# Altium schematic sheet Sheet1.SchDoc
size A4
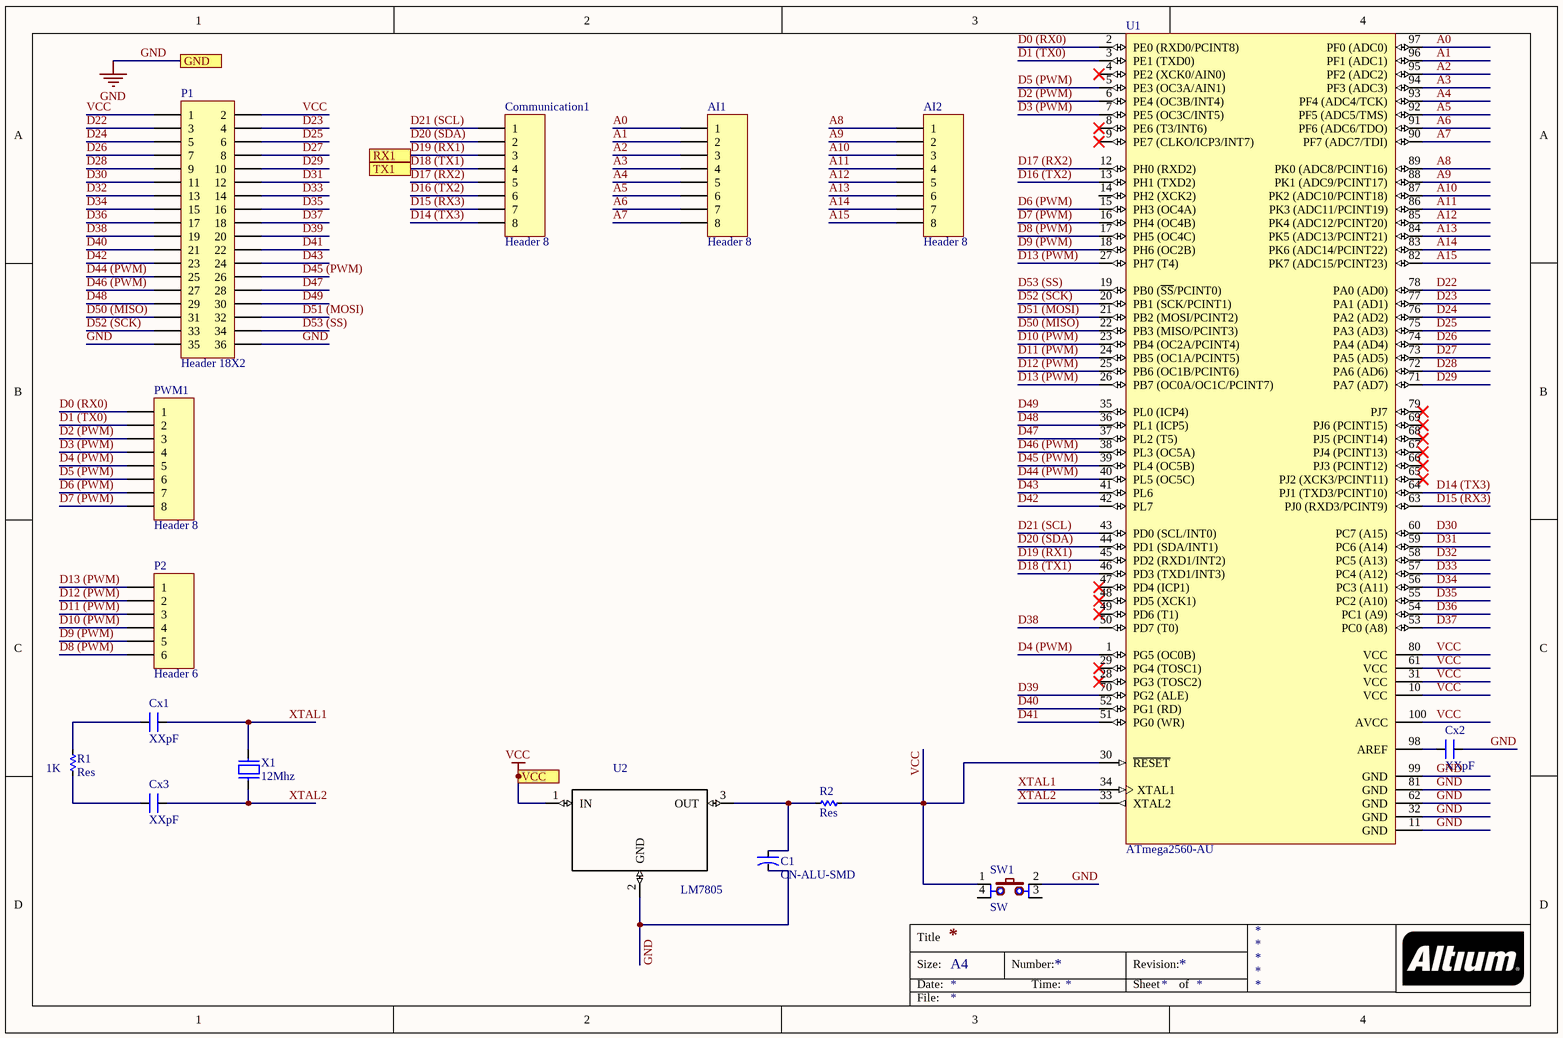
[diagram p0: Sheet1.SchDoc]

## Parts
AI1  Header 8  [HDR1X8]
AI2  Header 8  [HDR1X8]
C1  CN-ALU-SMD  [CAP-ALU-SMD-4.5x5x1.4]
Communication1  Header 8  [HDR1X8]
Cx1  XXpF  [CN-SMD-1206]
Cx2  XXpF  [CN-SMD-1206]
Cx3  XXpF  [CN-SMD-1206]
P1  Header 18X2  [HDR2X18]
P2  Header 6  [HDR1X6]
PWM1  Header 8  [HDR1X8]
R1  Res  value 1K  [RES-SMD-1206]
R2  Res  [RES-SMD-1206]
SW1  SW  [SW2-DIP]
U1  ATmega2560-AU  [TQFP100L]
U2  LM7805  [*TO220]
X1  12Mhz  [XT2]

## Ports
GND, RX1, TX1, VCC

## Nets
GND: C1.2 Cx2.2 P1.35 P1.36 SW1.2 U1.11(GND) U1.32(GND) U1.62(GND) U1.81(GND) U1.99(GND) U2.2(GND) ; port GND
VCC: P1.1 P1.2 R2.1 SW1.1 U1.10(VCC) U1.30(~{RESET}) U1.31(VCC) U1.61(VCC) U1.80(VCC) U1.100(AVCC) U2.1(IN) ; port VCC
A0: AI1.1 U1.97(PF0_(ADC0))
A1: AI1.2 U1.96(PF1_(ADC1))
A2: AI1.3 U1.95(PF2_(ADC2))
A3: AI1.4 U1.94(PF3_(ADC3))
A4: AI1.5 U1.93(PF4_(ADC4/TCK))
A5: AI1.6 U1.92(PF5_(ADC5/TMS))
A6: AI1.7 U1.91(PF6_(ADC6/TDO))
A7: AI1.8 U1.90(PF7_(ADC7/TDI))
A8: AI2.1 U1.89(PK0_(ADC8/PCINT16))
A9: AI2.2 U1.88(PK1_(ADC9/PCINT17))
A10: AI2.3 U1.87(PK2_(ADC10/PCINT18))
A11: AI2.4 U1.86(PK3_(ADC11/PCINT19))
A12: AI2.5 U1.85(PK4_(ADC12/PCINT20))
A13: AI2.6 U1.84(PK5_(ADC13/PCINT21))
A14: AI2.7 U1.83(PK6_(ADC14/PCINT22))
A15: AI2.8 U1.82(PK7_(ADC15/PCINT23))
D0 (RX0): PWM1.1 U1.2(PE0_(RXD0/PCINT8))
D1 (TX0): PWM1.2 U1.3(PE1_(TXD0))
D2 (PWM): PWM1.3 U1.6(PE4_(OC3B/INT4))
D3 (PWM): PWM1.4 U1.7(PE5_(OC3C/INT5))
D4 (PWM): PWM1.5 U1.1(PG5_(OC0B))
D5 (PWM): PWM1.6 U1.5(PE3_(OC3A/AIN1))
D6 (PWM): PWM1.7 U1.15(PH3_(OC4A))
D7 (PWM): PWM1.8 U1.16(PH4_(OC4B))
D8 (PWM): P2.6 U1.17(PH5_(OC4C))
D9 (PWM): P2.5 U1.18(PH6_(OC2B))
D10 (PWM): P2.4 U1.23(PB4_(OC2A/PCINT4))
D11 (PWM): P2.3 U1.24(PB5_(OC1A/PCINT5))
D12 (PWM): P2.2 U1.25(PB6_(OC1B/PCINT6))
D13 (PWM): P2.1 U1.26(PB7_(OC0A/OC1C/PCINT7)) U1.27(PH7_(T4))
D14 (TX3): Communication1.8 U1.64(PJ1_(TXD3/PCINT10))
D15 (RX3): Communication1.7 U1.63(PJ0_(RXD3/PCINT9))
D16 (TX2): Communication1.6 U1.13(PH1_(TXD2))
D17 (RX2): Communication1.5 U1.12(PH0_(RXD2))
D18 (TX1): Communication1.4 U1.46(PD3_(TXD1/INT3)) ; port TX1
D19 (RX1): Communication1.3 U1.45(PD2_(RXD1/INT2)) ; port RX1
D20 (SDA): Communication1.2 U1.44(PD1_(SDA/INT1))
D21 (SCL): Communication1.1 U1.43(PD0_(SCL/INT0))
D22: P1.3 U1.78(PA0_(AD0))
D23: P1.4 U1.77(PA1_(AD1))
D24: P1.5 U1.76(PA2_(AD2))
D25: P1.6 U1.75(PA3_(AD3))
D26: P1.7 U1.74(PA4_(AD4))
D27: P1.8 U1.73(PA5_(AD5))
D28: P1.9 U1.72(PA6_(AD6))
D29: P1.10 U1.71(PA7_(AD7))
D30: P1.11 U1.60(PC7_(A15))
D31: P1.12 U1.59(PC6_(A14))
D32: P1.13 U1.58(PC5_(A13))
D33: P1.14 U1.57(PC4_(A12))
D34: P1.15 U1.56(PC3_(A11))
D35: P1.16 U1.55(PC2_(A10))
D36: P1.17 U1.54(PC1_(A9))
D37: P1.18 U1.53(PC0_(A8))
D38: P1.19 U1.50(PD7_(T0))
D39: P1.20 U1.70(PG2_(ALE))
D40: P1.21 U1.52(PG1_(RD))
D41: P1.22 U1.51(PG0_(WR))
D42: P1.23 U1.42(PL7)
D43: P1.24 U1.41(PL6)
D44 (PWM): P1.25 U1.40(PL5_(OC5C))
D45 (PWM): P1.26 U1.39(PL4_(OC5B))
D46 (PWM): P1.27 U1.38(PL3_(OC5A))
D47: P1.28 U1.37(PL2_(T5))
D48: P1.29 U1.36(PL1_(ICP5))
D49: P1.30 U1.35(PL0_(ICP4))
D50 (MISO): P1.31 U1.22(PB3_(MISO/PCINT3))
D51 (MOSI): P1.32 U1.21(PB2_(MOSI/PCINT2))
D52 (SCK): P1.33 U1.20(PB1_(SCK/PCINT1))
D53 (SS): P1.34 U1.19(PB0_(~{SS}/PCINT0))
XTAL1: Cx1.2 U1.34(XTAL1) X1.2
XTAL2: Cx3.2 U1.33(XTAL2) X1.1
NetC1_1: C1.1 R2.2 U2.3(OUT)
NetCx1_1: Cx1.1 R1.1
NetCx2_1: Cx2.1 U1.98(AREF)
NetCx3_1: Cx3.1 R1.2

Not connected (* = marked no-connect by the designer): SW1 3 4; U1 4(PE2_(XCK0/AIN0))* 8(PE6_(T3/INT6))* 9(PE7_(CLKO/ICP3/INT7))* 14(PH2_(XCK2)) 28(PG3_(TOSC2))* 29(PG4_(TOSC1))* 47(PD4_(ICP1))* 48(PD5_(XCK1))* 49(PD6_(T1))* 65(PJ2_(XCK3/PCINT11))* 66(PJ3_(PCINT12))* 67(PJ4_(PCINT13))* 68(PJ5_(PCINT14))* 69(PJ6_(PCINT15))* 79(PJ7)*

## Notes on the sheet
- Title
- Size:
- Date:
- A4
- Number:
- Time:
- Revision:
- Sheet
- of
- File:

## Library data of the parts
AI1 AI2 Communication1 PWM1 = Header 8: Header, 8-Pin; LatestRevisionDate: 17-Jul-2002; LatestRevisionNote: Re-released for DXP Platform.; Publisher: Altium Limited
C1 = CN-ALU-SMD: Polarized Capacitor (Axial); Published: 8-Jun-2000; LatestRevisionDate: 17-Jul-2002; LatestRevisionNote: Re-released for DXP Platform.; PackageReference: POLAR0.8; Publisher: Altium Limited
Cx1 Cx3 = CN: Value: 22pF
Cx2 = CN: Value: 33pF
P1 = Header 18X2: Header, 18-Pin, Dual row; LatestRevisionDate: 17-Jul-2002; LatestRevisionNote: Re-released for DXP Platform.; Publisher: Altium Limited
P2 = Header 6: Header, 6-Pin; LatestRevisionDate: 17-Jul-2002; LatestRevisionNote: Re-released for DXP Platform.; Publisher: Altium Limited
R1 R2 = Res-SMD: Resistor; Manufacturer: Generic Components; Class: Passive; Published: 08/06/2000; Publisher: Altium Hobart Technology Centre
SW1 = SW4: Switch button 4 pin; Value: Button chip 4 pin
U1 = ATmega2560-AU: 8-bit AVR Microcontroller, 4.5-5.5V, 256KB Flash, 4KB EEPROM, 8KB SRAM, 86 GPIO pins, 100-pin TQFP, Industrial Grade (-40°C to 85°C), Pb-Free; Supplier 1: Digi-Key; Supplier Part Number 1: ATMEGA2560-16AUR-ND
U2 = LM7805: MF: Texas Instruments; SnapEDA_Link: https://www.snapeda.com/parts/LM7805/Texas%20Instruments/view-part/?ref=snap; Availability: Unavailable; Price: None; MP: LM7805; Package: TO-220 Texas Instruments; Value: *
X1 = XT2: Crystal, 32.768 KHz, -40 to 85 degC, 3.2 x 1.5 x 0.9 mm SMD; Value: 4Mhz